# EAGLE schematic riffle-base-simple-DS3231-prune (EAGLE 6.5.0)
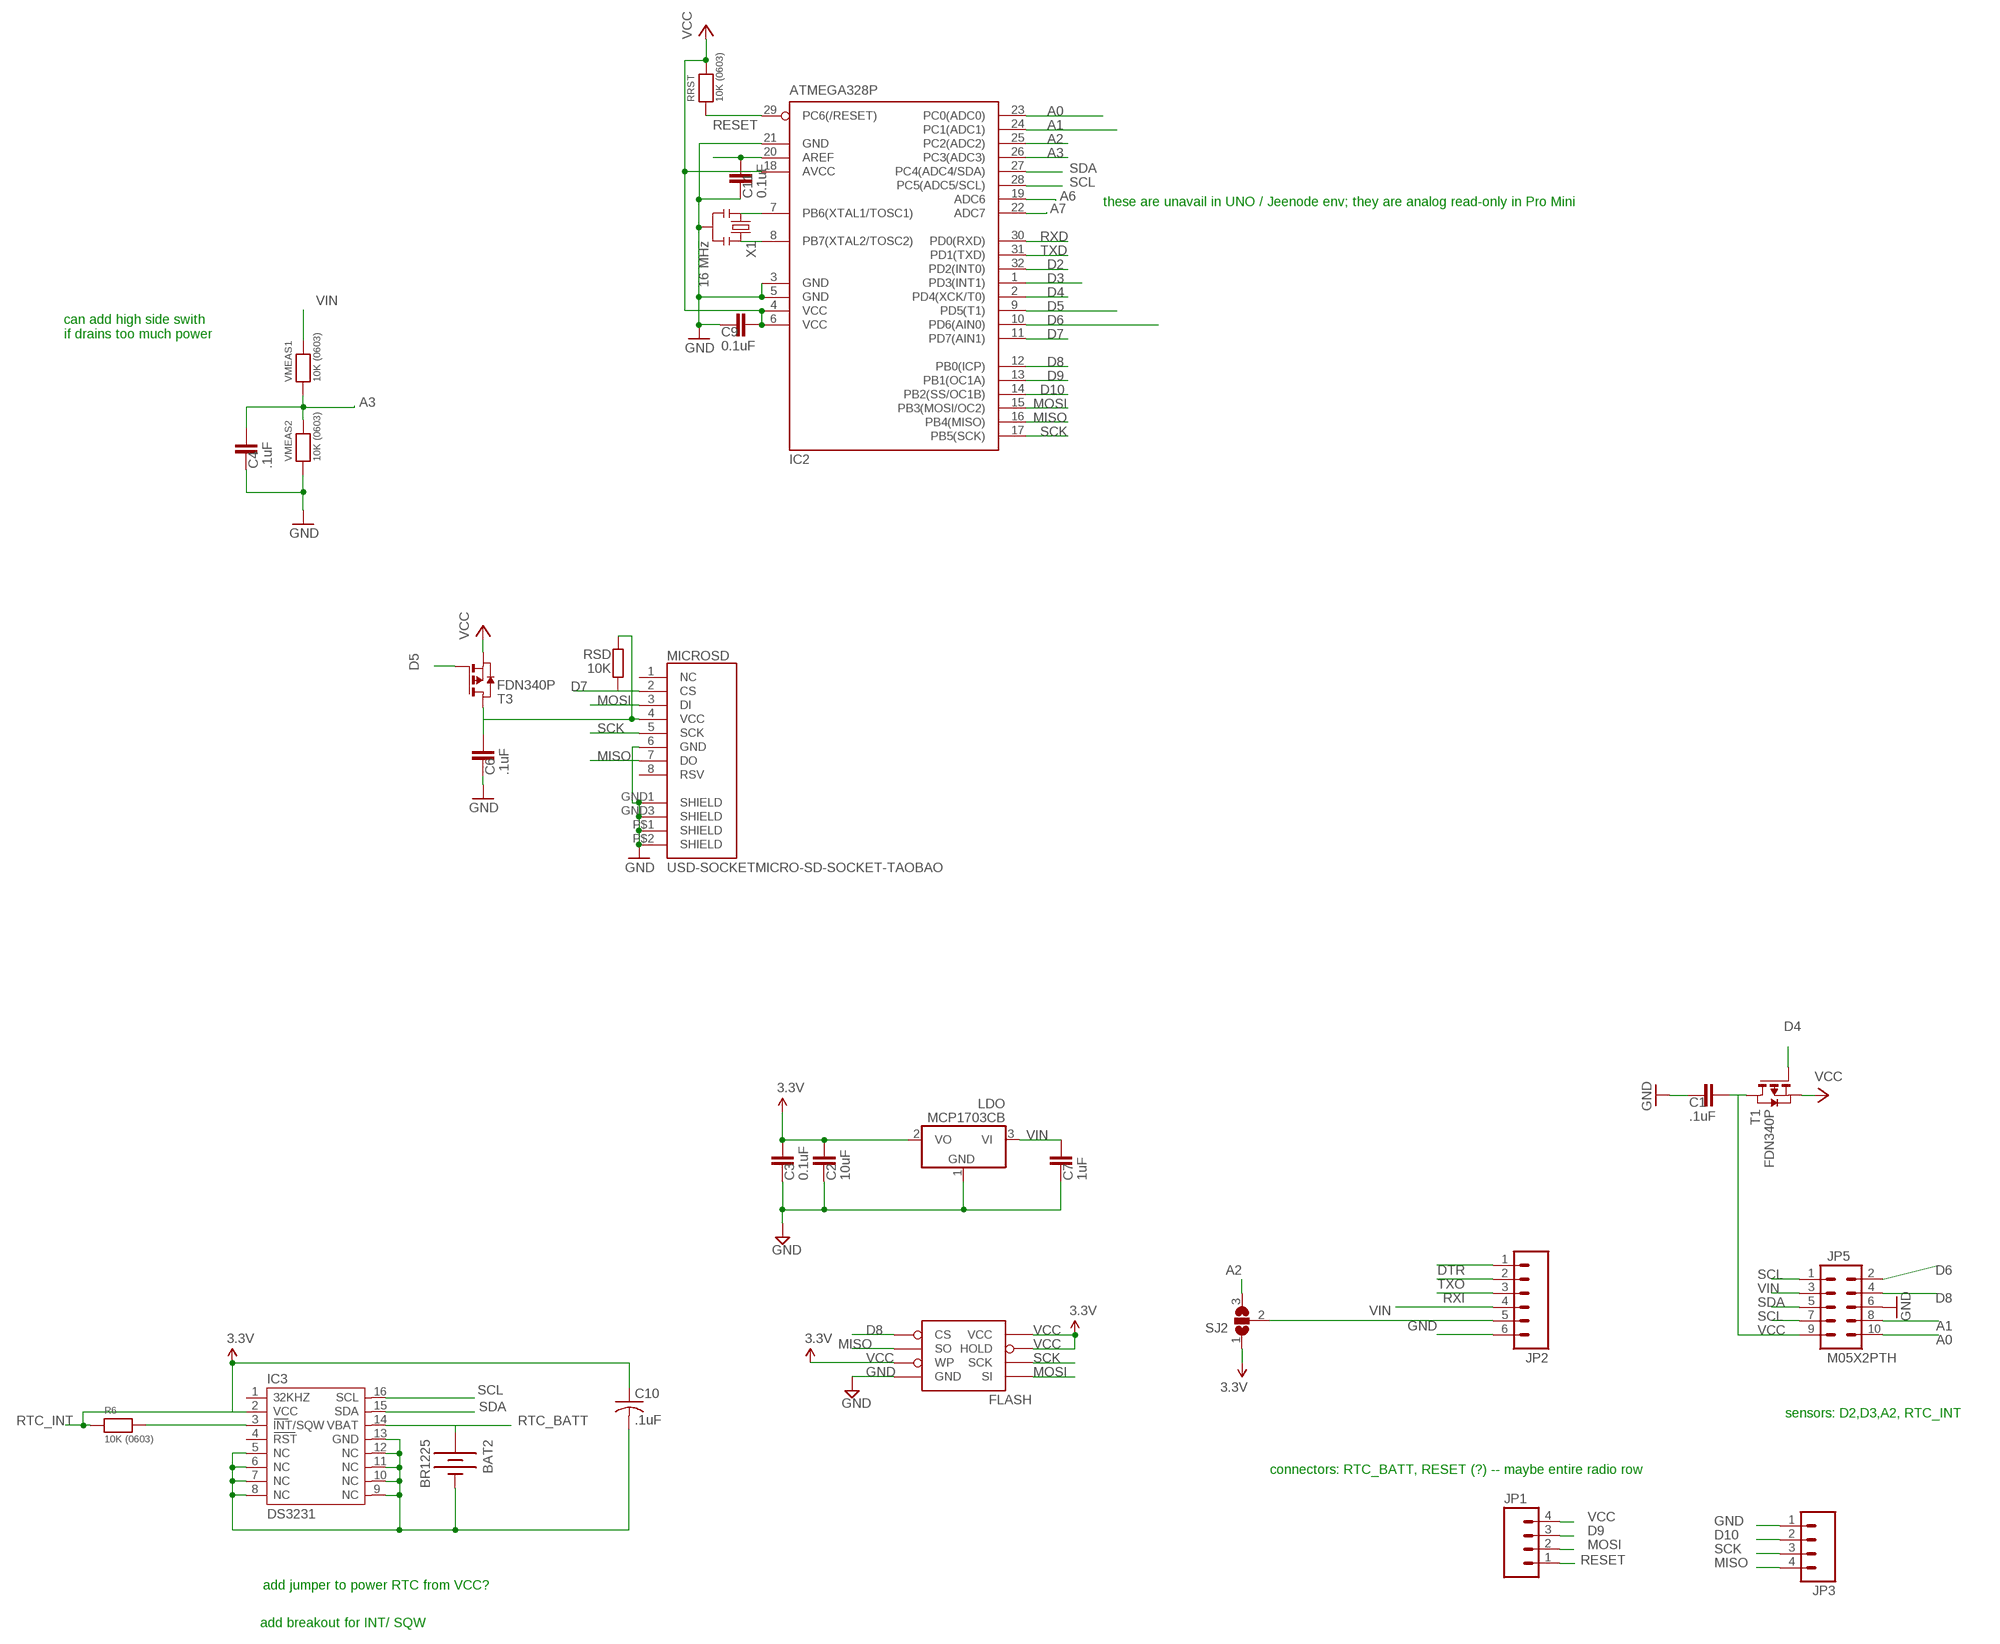
[diagram p0: schematic, sheet 1]

## Parts
BAT2  BR1225  BATTERY12PTH  [BATTCON_12MM_PTH]
C1  .1uF  C-EUC0805  [C0805@1]
C2  10uF  C-EUC0805  [C0805@1]
C3  0.1uF  C-EUC0805  [C0805@1]
C4  .1uF  C-EUC0805  [C0805@1]
C6  .1uF  C-EUC0805  [C0805@1]
C7  1uF  C-EUC0805  [C0805@1]
C9  0.1uF  C-EUC0805  [C0805@1]
C10  .1uF  C-USC0805  [C0805]
C11  0.1uF  C-EUC0805  [C0805@1]
FLASH  AT25F512BWIDE_5.3MM  [SO08WIDE]
IC2  ATMEGA328P  MEGA8-AI  [TQFP32-08]
IC3  DS3231  [DS3231]
JP1  M04LOCK  [1X04_LOCK]
JP2  M06LOCK  [1X06_LOCK]
JP3  M04LOCK  [1X04_LOCK]
JP5  M05X2PTH  [AVR_ICSP]
LDO  MCP1703CB  [SOT23]
MICROSD  USD-SOCKETMICRO-SD-SOCKET-TAOBAO  [MICRO-SD-SOCKET-TAOBAO]
R6  10K (0603)  RESISTOR_0603_NOOUT  [0603-NO]
RRST  10K (0603)  RESISTOR_0603_NOOUT  [0603-NO]
RSD  10K  R-EU_R0805  [R0805]
SJ2  SJ2W  [SJ_2]
T1  FDN340P  PMOSSOT23  [SOT-23]
T3  FDN340P  PMOSSOT23  [SOT-23]
VMEAS1  10K (0603)  RESISTOR_0603_NOOUT  [0603-NO]
VMEAS2  10K (0603)  RESISTOR_0603_NOOUT  [0603-NO]
X1  16 MHz  RESONATORSMD  [RESONATOR-SMD]

## Nets
A0: IC2.23(PC0(ADC0)) JP5.10
A1: IC2.24(PC1(ADC1)) JP5.8
A2: IC2.25(PC2(ADC2)) SJ2.3
A3: C4.2 IC2.26(PC3(ADC3)) VMEAS1.1 VMEAS2.2
A6: IC2.19(ADC6)
A7: IC2.22(ADC7)
AREF: C11.2 IC2.20(AREF)
D2: IC2.32(PD2(INT0))
D3: IC2.1(PD3(INT1))
D4: IC2.2(PD4(XCK/T0)) T1.3(G)
D5: IC2.9(PD5(T1)) T3.3(G)
D6: IC2.10(PD6(AIN0)) JP5.2
D7: IC2.11(PD7(AIN1)) MICROSD.2(CS) RSD.1
D8: FLASH.1(CS) IC2.12(PB0(ICP)) JP5.4
D9: IC2.13(PB1(OC1A)) JP1.3
D10: IC2.14(PB2(SS/OC1B)) JP3.2
DTR: JP2.1
GND [power]: BAT2.GND(-) C1.1 C2.1 C3.1 C4.1 C6.1 C7.1 C9.1 C10.2 C11.1 FLASH.4(GND) IC2.3(GND) IC2.5(GND) IC2.21(GND) IC3.5(NC) IC3.6(NC) IC3.7(NC) IC3.8(NC) IC3.9(NC) IC3.10(NC) IC3.11(NC) IC3.12(NC) IC3.13(GND) JP2.6 JP3.1 JP5.6 LDO.1(GND) MICROSD.6(GND) MICROSD.GND1(SHIELD) MICROSD.GND3(SHIELD) MICROSD.P$1(SHIELD) MICROSD.P$2(SHIELD) VMEAS2.1 X1.2
MISO: FLASH.2(SO) IC2.16(PB4(MISO)) JP3.4 MICROSD.7(DO)
MOSI: FLASH.5(SI) IC2.15(PB3(MOSI/OC2)) JP1.2 MICROSD.3(DI)
N$2: IC2.8(PB7(XTAL2/TOSC2)) X1.3
N$3: JP2.5 SJ2.2
N$5: IC2.7(PB6(XTAL1/TOSC1)) X1.1
N$16: IC3.3(INT/SQW) R6.2
N$31: C6.2 MICROSD.4(VCC) RSD.2 T3.1(D)
RESET: IC2.29(PC6(/RESET)) JP1.1 RRST.1
RTC_BATT: BAT2.VCC@1(+) IC3.14(VBAT)
RTC_INT: C10.1 IC3.2(VCC) R6.1 ; supply symbol labelled 3.3V
RXD: IC2.30(PD0(RXD))
RXI: JP2.3
SCK: FLASH.6(SCK) IC2.17(PB5(SCK)) JP3.3 MICROSD.5(SCK)
SCL: IC2.28(PC5(ADC5/SCL)) IC3.16(SCL) JP5.1 JP5.7
SDA: IC2.27(PC4(ADC4/SDA)) IC3.15(SDA) JP5.5
TXD: IC2.31(PD1(TXD))
TXO: JP2.2
VCC: C1.2 C2.2 C3.2 C9.2 FLASH.3(WP) FLASH.7(HOLD) FLASH.8(VCC) IC2.4(VCC) IC2.6(VCC) IC2.18(AVCC) JP1.4 JP5.9 LDO.2(VO) RRST.2 SJ2.1 T1.1(D) T1.2(S) T3.2(S) ; supply symbol labelled 3.3V
VIN [power]: C7.2 JP2.4 JP5.3 LDO.3(VI) VMEAS1.2
Unconnected: IC3.1(32KHZ) IC3.4(RST) MICROSD.1(NC) MICROSD.8(RSV)

## Notes on the sheet
- these are unavail in UNO / Jeenode env; they are analog read-only in Pro Mini
- can add high side swith
  if drains too much power
- sensors: D2,D3,A2, RTC_INT
- connectors: RTC_BATT, RESET (?) -- maybe entire radio row
- add jumper to power RTC from VCC?
- add breakout for INT/ SQW

## Library data of the parts
BAT2 = SparkFun:BATTERY: Battery Holders Various common sizes : AA, AAA, 20mm coin cell and 12mm coin cell.
C1-C4 C6 C7 C9 C11 = rcl:C-EU: CAPACITOR, European symbol
C10 = rcl:C-US: CAPACITOR, American symbol
FLASH = LowPowerLab:AT25F512B: 4-Mbit SPI flash memory
IC2 = atmel:MEGA8: MICROCONTROLLER 8 Kbytes FLASH, 1 kbytes SRAM, 512 bytes EEPROM, USART, 6-channel 10 bit ADC, 2-channel 8 bit ADC Pin compatible with Atmega48, ATMega88, ATMega168 Source: avr.lbr; MPN: ATMEGA8-16AU; OC_FARNELL: 9171371; OC_NEWARK: 73M8863
IC3 = _lh-library:DS3231
JP1 JP3 = SparkFun-Connectors:M04: Header 4 Standard 4-pin 0.1" header. Use with straight break away headers (SKU : PRT-00116), right angle break away headers (PRT-00553), swiss pins (PRT-00743), machine pins (PRT-00117), and female headers (PRT-00115). Molex polarized connector foot print use with SKU : PRT-08231 with associated crimp pins and housings. 1MM SMD Version SKU: PRT-10208
JP2 = SparkFun-Connectors:M06: Header 6 Standard 6-pin 0.1" header. Use with straight break away headers (SKU : PRT-00116), right angle break away headers (PRT-00553), swiss pins (PRT-00743), machine pins (PRT-00117), and female headers (PRT-00115). Molex polarized connector foot print use with SKU : PRT-08094 with associated crimp pins and housings. NOTES ON THE VARIANTS LOCK and LOCK_LONGPADS... This footprint was designed to help hold the alignment of a through-hole component (i.e. 6-pin header) while soldering it into place. You may notice that each hole has been shifted either up or down by 0.005 of an inch from it's more standard position (which is a perfectly straight line). This slight alteration caused the pins (the squares in the middle) to touch the edges of the holes. Because they are alternating, it causes a "brace" to hold the component in place. 0.005 has proven to be the perfect amount of "off-center" position when using our standard breakaway headers. Although looks a little odd when you look at the bare footprint, once you have a header in there, the alteration is very hard to notice. Also,if you push a header all the way into place, it is covered up entirely on the bottom side. This idea of altering the position of holes to aid alignment will be further integrated into the Sparkfun Library for other footprints. It can help hold any component with 3 or more connection pins.
JP5 = SparkFun-Connectors:M05X2: Header 5x2 Standard 10-pin dual row 0.1" header. Commonly used with AVR-ISP. Use with Spark Fun Electronics SKU: PRT-00778
LDO = linear:MCP1703: 250 mA, 16V, Low Quiescent Current LDO Regulator Source: http://ww1.microchip.com/downloads/en/DeviceDoc/22049b.pdf
MICROSD = SparkFunNew:USD-SOCKET: microSD Socket Push-push type uSD socket. Schematic element and footprint production proven. Spark Fun Electronics SKU : PRT-00127. tDoc lines correctly indicate media card edge positions when inserting (unlocked, locked, depressed).
R6 RRST VMEAS1 VMEAS2 = microbuilder:RESISTOR: Resistors For new designs, use the packages preceded by an '_' character since they are more reliable: The following footprints should be used on most boards: _0402 - Standard footprint for regular board layouts _0603 - Standard footprint for regular board layouts _0805 - Standard footprint for regular board layouts For extremely tight-pitch boards where space is at a premium, the following 'micro-pitch' footprints can be used (smaller pads, no silkscreen outline, etc.): _0402MP - Micro-pitch footprint for very dense/compact boards _0603MP - Micro-pitch footprint for very dense/compact boards _0805MP - Micro-pitch footprint for very dense/compact boards
RSD = rcl:R-EU_: RESISTOR, European symbol
SJ2 = jumper:SJ2W: SMD solder JUMPER
T1 T3 = zetex:PMOSSOT23: MOS FET
X1 = SparkFun:RESONATOR: Resonator Small SMD resonator. This is the itty bitty 10/20MHz resonators with built in caps. CSTCE10M0G55 and CSTCE20M0V53. Footprint has been reviewed closely but hasn't been tested yet.

## Net classes
1 power: width 0.381 mm, clearance 0.254 mm